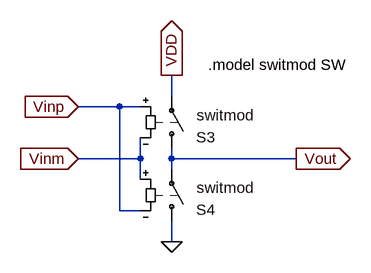
[diagram p0: schematic Ideal_comparator.asc]
Ideal_comparator.asc, the LTspice schematic file:
Version 4
SHEET 1 6308 700
WIRE 1840 -256 1776 -256
WIRE 1840 -96 1840 -256
WIRE 1872 -256 1840 -256
WIRE 1872 -176 1776 -176
WIRE 1872 -176 1872 -208
WIRE 1872 -144 1872 -176
WIRE 1872 -96 1840 -96
WIRE 1920 -272 1920 -304
WIRE 1920 -176 1920 -192
WIRE 1920 -160 1920 -176
WIRE 1920 -48 1920 -80
WIRE 2112 -176 1920 -176
FLAG 1776 -256 Vinp
IOPIN 1776 -256 In
FLAG 1920 -304 VDD
IOPIN 1920 -304 Out
FLAG 1920 -48 0
FLAG 1776 -176 Vinm
IOPIN 1776 -176 In
FLAG 2112 -176 Vout
IOPIN 2112 -176 Out
SYMBOL sw 1920 -176 M180
WINDOW 3 24 -12 Left 0
WINDOW 38 39 67 Left 0
WINDOW 0 38 33 Left 0
SYMATTR Value ""
SYMATTR SpiceModel switmod
SYMATTR InstName S3
SYMBOL sw 1920 -64 M180
WINDOW 3 24 -12 Left 0
WINDOW 38 39 67 Left 0
WINDOW 0 38 33 Left 0
SYMATTR Value ""
SYMATTR SpiceModel switmod
SYMATTR InstName S4
TEXT 1976 -320 Left 0 !.model switmod SW

The netlist it stands for:
* Ideal_comparator.asc
S3 Vout VDD Vinp Vinm switmod
S4 0 Vout Vinm Vinp switmod
.model switmod SW
.backanno
.end